# Altium project Satellite_Control.PrjPcb
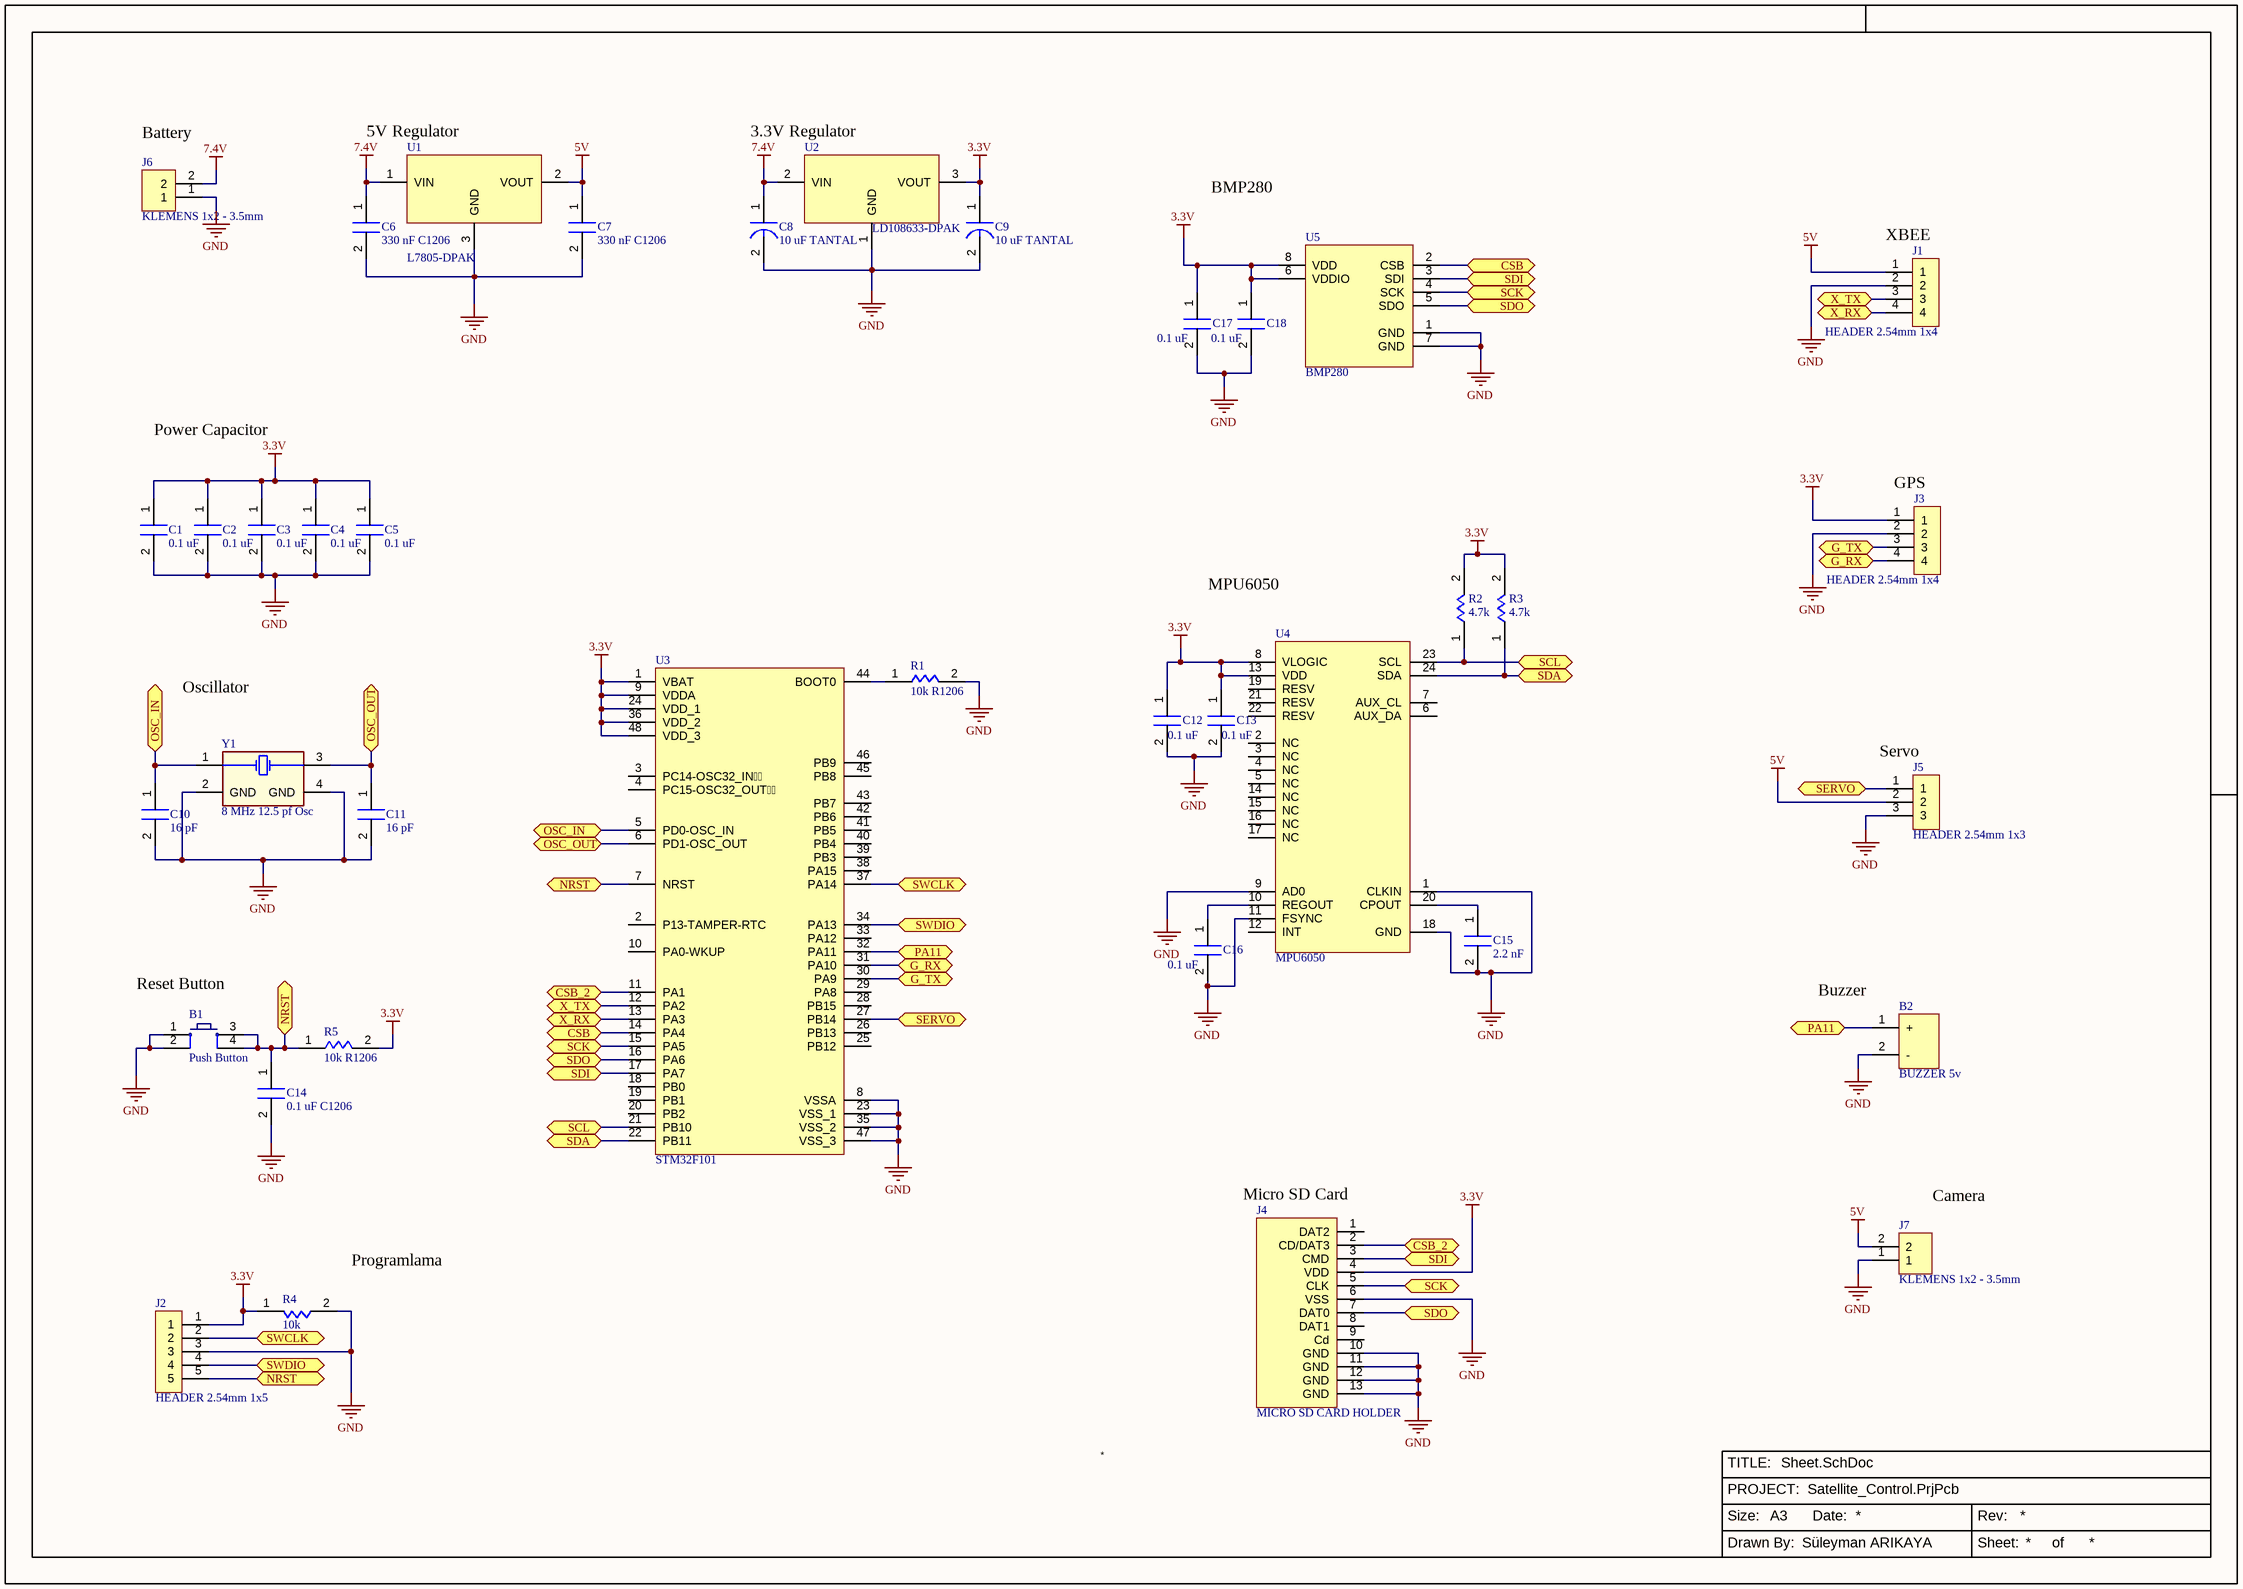
[diagram p0: Sheet.SchDoc]
1 sheet, 38 parts. Net scope: flat (ports and power ports of the same name join across sheets).
Board file: PCB.PcbDoc

## Sheet Sheet.SchDoc
size 420 x 297 mm

### Parts
B1  Push Button  [PUSB BUTTON-SMD]
B2  BUZZER 5v  [BUZZER 5v]
C1  0.1 uF  [C1206]
C2  0.1 uF  [C1206]
C3  0.1 uF  [C1206]
C4  0.1 uF  [C1206]
C5  0.1 uF  [C1206]
C6  330 nF C1206  [C1206]
C7  330 nF C1206  [C1206]
C8  10 uF TANTAL  [C1206 - TANTAL]
C9  10 uF TANTAL  [C1206 - TANTAL]
C10  16 pF  [C1206]
C11  16 pF  [C1206]
C12  0.1 uF  [C1206]
C13  0.1 uF  [C1206]
C14  0.1 uF C1206  [C1206]
C15  2.2 nF  [C1206]
C16  0.1 uF  [C1206]
C17  0.1 uF  [C1206]
C18  0.1 uF  [C1206]
J1  HEADER 2.54mm 1x4  [HEADER 2.54mm 1x4]
J2  HEADER 2.54mm 1x5  [HEADER 2.54mm 1x5]
J3  HEADER 2.54mm 1x4  [HEADER 2.54mm 1x4]
J4  MICRO SD CARD HOLDER  [MICRO SD CARD HOLDER]
J5  HEADER 2.54mm 1x3  [HEADER 2.54mm 1x3]
J6  KLEMENS 1x2 - 3.5mm  [KLEMENS 1x2 - 3.5mm]
J7  KLEMENS 1x2 - 3.5mm  [KLEMENS 1x2 - 3.5mm]
R1  10k R1206  [R1206 RESISTOR]
R2  4.7k  [R1206 RESISTOR]
R3  4.7k  [R1206 RESISTOR]
R4  10k  [R1206 RESISTOR]
R5  10k R1206  [R1206 RESISTOR]
U1  L7805-DPAK  [DPAK228P972X240-3N]
U2  LD108633-DPAK  [DPAK228P972X240-3N]
U3  STM32F101  [LQPF48_STM]
U4  MPU6050  [QFN50P400X400X95_HS-25N]
U5  BMP280  [BMP280]
Y1  8 MHz 12.5 pf Osc  [8 MHZ Osc.]

### Ports
CSB (bidir), CSB_2 (bidir), G_RX (bidir), G_TX (bidir), NRST (bidir), OSC_IN (bidir), OSC_OUT (bidir), PA11 (bidir), SCK (bidir), SCL (bidir), SDA (bidir), SDI (bidir), SDO (bidir), SERVO (bidir), SWCLK (bidir), SWDIO (bidir), X_RX (bidir), X_TX (bidir)

### Nets
3.3V: C1.1 C2.1 C3.1 C4.1 C5.1 C9.1 C12.1 C13.1 C17.1 C18.1 J2.1 J3.1 J4.4(VDD) R2.2 R3.2 R4.1 R5.2 U2.3(VOUT) U3.1(VBAT) U3.9(VDDA) U3.24(VDD_1) U3.36(VDD_2) U3.48(VDD_3) U4.8(VLOGIC) U4.13(VDD) U5.6(VDDIO) U5.8(VDD)
5V: C7.1 J1.1 J5.2 J7.2 U1.2(VOUT)
7.4V: C6.1 C8.1 J6.2 U1.1(VIN) U2.2(VIN)
GND: B1.1 B1.2 B2.2(-) C1.2 C2.2 C3.2 C4.2 C5.2 C6.2 C7.2 C8.2 C9.2 C10.2 C11.2 C12.2 C13.2 C14.2 C15.2 C16.2 C17.2 C18.2 J1.2 J2.3 J3.2 J4.6(VSS) J4.10(GND) J4.11(GND) J4.12(GND) J4.13(GND) J5.3 J6.1 J7.1 R1.2 R4.2 U1.3(GND) U2.1(GND) U3.8(VSSA) U3.23(VSS_1) U3.35(VSS_2) U3.47(VSS_3) U4.1(CLKIN) U4.9(AD0) U4.11(FSYNC) U4.18(GND) U5.1(GND) U5.7(GND) Y1.2(GND) Y1.4(GND)
NetB1_3: B1.3 B1.4 C14.1 J2.5 R5.1 U3.7(NRST) ; port NRST
NetB2_1: B2.1(+) U3.32(PA11) ; port PA11
NetC10_1: C10.1 U3.5(PD0-OSC_IN) Y1.1 ; port OSC_IN
NetC11_1: C11.1 U3.6(PD1-OSC_OUT) Y1.3 ; port OSC_OUT
NetC15_1: C15.1 U4.20(CPOUT)
NetC16_1: C16.1 U4.10(REGOUT)
NetJ1_3: J1.3 U3.12(PA2) ; port X_TX
NetJ1_4: J1.4 U3.13(PA3) ; port X_RX
NetJ2_2: J2.2 U3.37(PA14) ; port SWCLK
NetJ2_4: J2.4 U3.34(PA13) ; port SWDIO
NetJ3_3: J3.3 U3.30(PA9) ; port G_TX
NetJ3_4: J3.4 U3.31(PA10) ; port G_RX
NetJ4_2: J4.2(CD/DAT3) U3.11(PA1) ; port CSB_2
NetJ4_3: J4.3(CMD) U3.17(PA7) U5.3(SDI) ; port SDI
NetJ4_5: J4.5(CLK) U3.15(PA5) U5.4(SCK) ; port SCK
NetJ4_7: J4.7(DAT0) U3.16(PA6) U5.5(SDO) ; port SDO
NetJ5_1: J5.1 U3.27(PB14) ; port SERVO
NetR1_1: R1.1 U3.44(BOOT0)
NetR2_1: R2.1 U3.21(PB10) U4.23(SCL) ; port SCL
NetR3_1: R3.1 U3.22(PB11) U4.24(SDA) ; port SDA
NetU3_14: U3.14(PA4) U5.2(CSB) ; port CSB

Not connected (* = marked no-connect by the designer): J4 1(DAT2) 8(DAT1) 9(Cd); U3 2(P13-TAMPER-RTC) 3(PC14-OSC32_IN) 4(PC15-OSC32_OUT) 10(PA0-WKUP) 18(PB0) 19(PB1) 20(PB2) 25(PB12) 26(PB13) 28(PB15) 29(PA8) 33(PA12) 38(PA15) 39(PB3) 40(PB4) 41(PB5) 42(PB6) 43(PB7) 45(PB8) 46(PB9); U4 2(NC) 3(NC) 4(NC) 5(NC) 6(AUX_DA) 7(AUX_CL) 12(INT) 14(NC) 15(NC) 16(NC) 17(NC) 19(RESV) 21(RESV) 22(RESV)

### Notes on the sheet
- (near J6) Battery
- (near U1) 5V Regulator
- (near U2) 3.3V Regulator
- BMP280
- (near J1) XBEE
- Power Capacitor
- (near J3) GPS
- MPU6050
- Oscillator
- (near J5) Servo
- (near B1) Reset Button
- (near B2) Buzzer
- (near J4) Micro SD Card
- (near J7) Camera
- (near R4) Programlama
- TITLE:
- PROJECT:
- Size:
- A3
- Date:
- Rev:
- Drawn By:
- Süleyman ARIKAYA
- Sheet:
- of

### Library data of the parts
B1 = Push Button: Smd Push Button; Satın Alma Linki: https://urun.n11.com/diger/mini-pushbutton-switch-smd-P227461537?gclid=Cj0KCQjwkoDmBRCcARIsAG3xzl8Y_-jeD7HocNM6lvuZ_rVp83568XPGtNzlPwXWLph8oCRqo0yh87UaApZYEALw_wcB&gclsrc=aw.ds
C1-C5 C12 C13 C16-C18 = 0.1 uF C1206
C8 C9 = 10 uF TANTAL: 10 uF C1206 - TANTAL
C15 = 2.2 nF: 2.2 nF C1206
J4 = MICRO SD CARD HOLDER: MICRO SD CARD HOLDER KLS1-TF-003 Micro SD Card Connector
R2 R3 = 4.7k: 4.7k R1206
R4 = 10k: 10k R1206
U1 = L7805-DPAK: L7805 5V REGULATOR SMD PACKET
U2 = LD108633-DPAK: LD108633 3.3V REGULATOR DPAK
U3 = STM32F101: STM32F101 48PIN MICROPROCESSOR
U4 = MPU6050: MPU GYRO
U5 = BMP280: BMP280 PRESSURE